# Altium schematic sheet CSI.SchDoc
size A; SheetNumber: 2; SheetTotal: 7
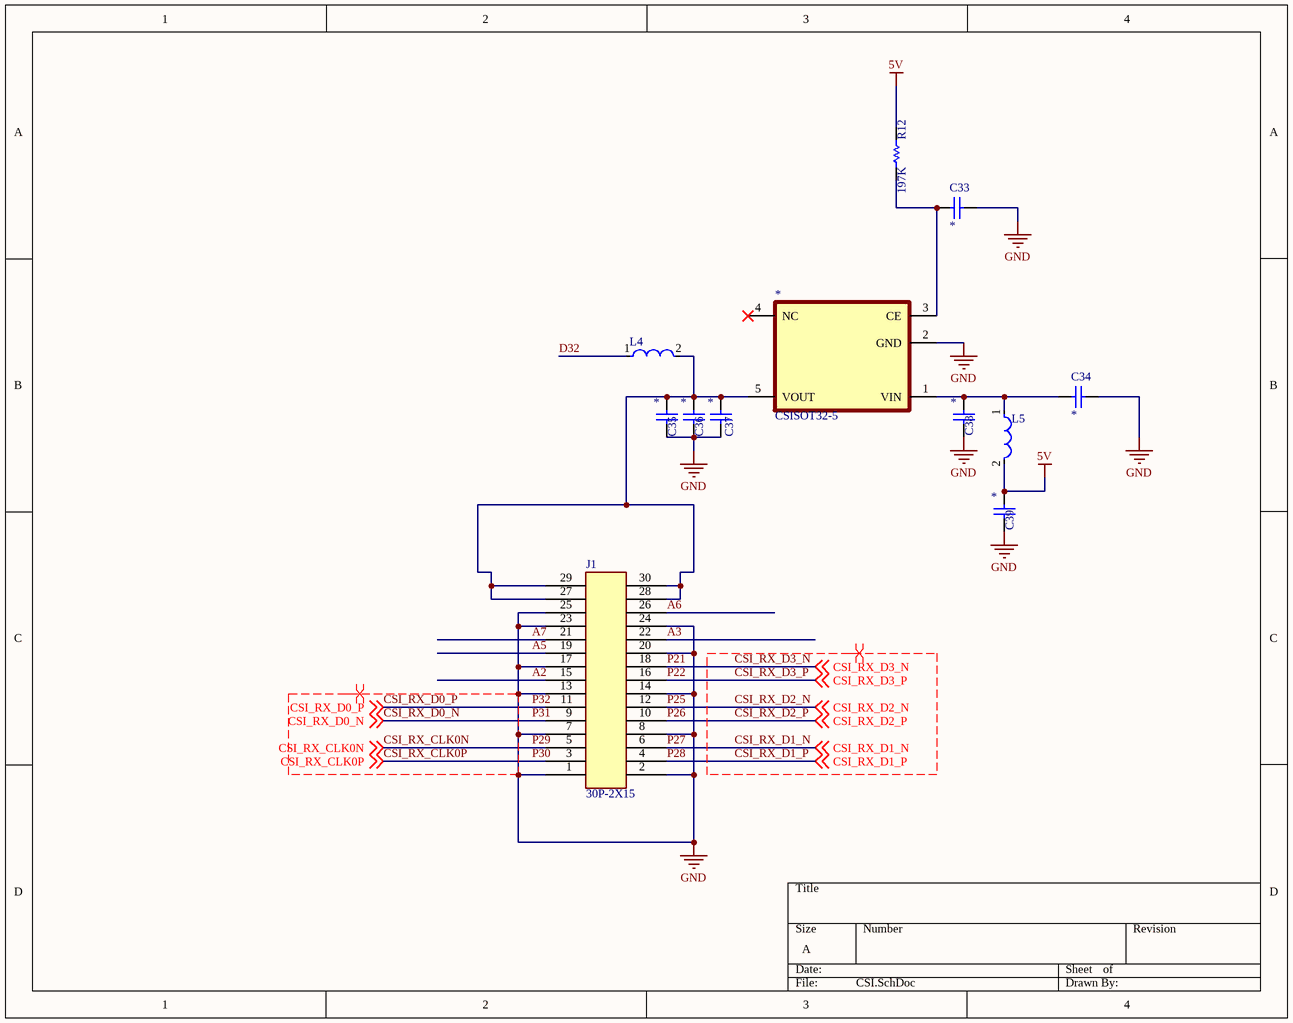
[diagram p0: CSI.SchDoc]

## Parts
*  CSISOT32-5
C33  *  [CAPC1005X56X25LL10T15]
C34  *  [CAPC1005X56X25LL10T15]
C35  *  [CAPC1005X56X25LL10T15]
C36  *  [CAPC1005X56X25LL10T15]
C37  *  [CAPC1005X56X25LL10T15]
C38  *  [CAPC1005X56X25LL10T15]
C39  *  [CAPC1005X56X25LL10T15]
J1  30P-2X15
L4  (no value)  [FP-LQH31CN_03-MFG]
L5  (no value)  [FP-LQH31CN_03-MFG]
R12  197K  [RESC1005X40X25LL05T10]

## Nets
5V: C39.2 L5.2 R12.2
GND: *.2(GND) C33.2 C34.2 C35.1 C36.1 C37.1 C38.1 C39.1 J1.1 J1.2 J1.7 J1.8 J1.13 J1.14 J1.17 J1.20 J1.23 J1.24 J1.25
A2: J1.15
A3: J1.22
A5: J1.19
A6: J1.26
A7: J1.21
CSI_RX_CLK0N: J1.5 ; off-sheet CSI_RX_CLK0N  [also labelled P29]
CSI_RX_CLK0P: J1.3 ; off-sheet CSI_RX_CLK0P  [also labelled P30]
CSI_RX_D0_N: J1.9 ; off-sheet CSI_RX_D0_N  [also labelled P31]
CSI_RX_D0_P: J1.11 ; off-sheet CSI_RX_D0_P  [also labelled P32]
CSI_RX_D1_N: J1.6 ; off-sheet CSI_RX_D1_N  [also labelled P27]
CSI_RX_D1_P: J1.4 ; off-sheet CSI_RX_D1_P  [also labelled P28]
CSI_RX_D2_N: J1.12 ; off-sheet CSI_RX_D2_N  [also labelled P25]
CSI_RX_D2_P: J1.10 ; off-sheet CSI_RX_D2_P  [also labelled P26]
CSI_RX_D3_N: J1.18 ; off-sheet CSI_RX_D3_N  [also labelled P21]
CSI_RX_D3_P: J1.16 ; off-sheet CSI_RX_D3_P  [also labelled P22]
D32: L4.1
Net*_1: *.1(VIN) C34.1 C38.2 L5.1
Net*_3: *.3(CE) C33.1 R12.1
Net*_5: *.5(VOUT) C35.2 C36.2 C37.2 J1.27 J1.28 J1.29 J1.30 L4.2

Not connected (* = marked no-connect by the designer): * 4(NC)*

## Layout directives
differential pair; differential pair class CSI; net class CSI_DIFF: CSI_RX_CLK0N, CSI_RX_CLK0P, CSI_RX_D0_N, CSI_RX_D0_P, CSI_RX_D1_N, CSI_RX_D1_P, CSI_RX_D2_N, CSI_RX_D2_P, CSI_RX_D3_N, CSI_RX_D3_P

## Library data of the parts
C33-C39 = CMP-2008-02962-1: VALUE: *
L4 L5 = CMP-06042-002477-1
R12 = CMP-2002-07161-1: VALUE: 197K